# Altium schematic sheet 28Pins_Project_V1_Schematic.SchDoc
size A2
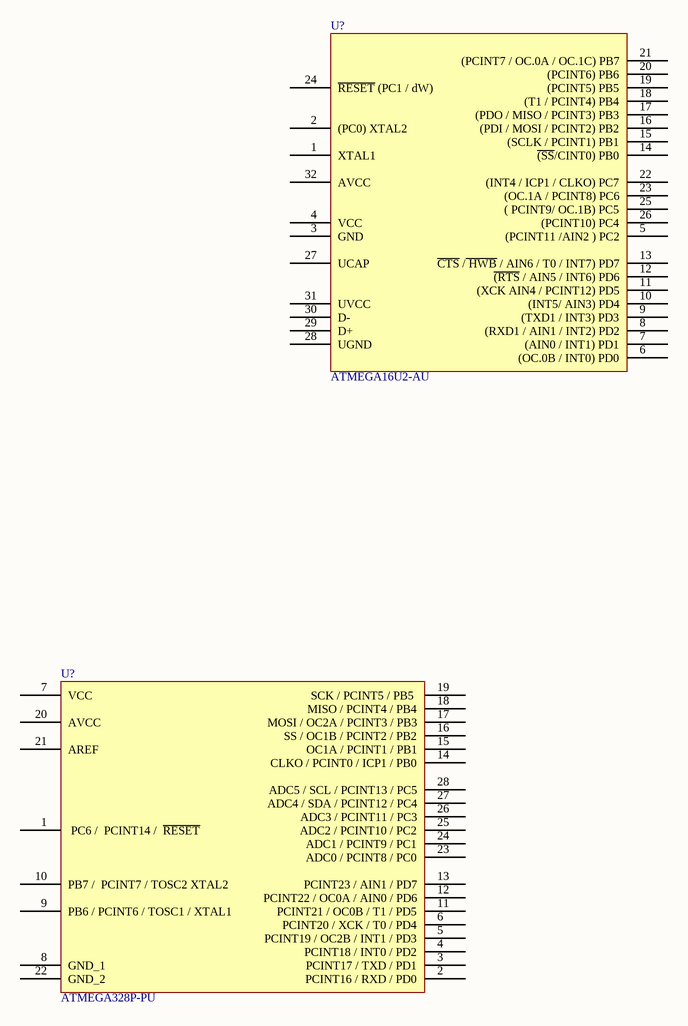
[diagram p0: 28Pins_Project_V1_Schematic.SchDoc]

## Parts
(Parts that share a designator on the sheet are numbered #1, #2 ... from top to bottom, then left to right.)
U?#1  ATMEGA16U2-AU  [TQFP32]
U?#2  ATMEGA328P-PU  [DIP_28_7.62mm]

## Nets

Not connected (* = marked no-connect by the designer): U?#1 1(XTAL1) 2((PC0)_XTAL2) 3(GND) 4(VCC) 5((PCINT11_/AIN2_)_PC2) 6((OC.0B_/_INT0)_PD0) 7((AIN0_/_INT1)_PD1) 8((RXD1_/_AIN1_/_INT2)_PD2) 9((TXD1_/_INT3)_PD3) 10((INT5/_AIN3)_PD4) 11((XCK_AIN4_/_PCINT12)_PD5) 12(~{(RTS}_/_AIN5_/_INT6)_PD6) 13(~{CTS}_/~{_HWB}_/_AIN6_/_T0_/_INT7)_PD7) 14(~{(SS}/CINT0)_PB0) 15((SCLK_/_PCINT1)_PB1) 16((PDI_/_MOSI_/_PCINT2)_PB2) 17((PDO_/_MISO_/_PCINT3)_PB3) 18((T1_/_PCINT4)_PB4) 19((PCINT5)_PB5) 20((PCINT6)_PB6) 21((PCINT7_/_OC.0A_/_OC.1C)_PB7) 22((INT4_/_ICP1_/_CLKO)_PC7) 23((OC.1A_/_PCINT8)_PC6) 24(~{RESET}_(PC1_/_dW)) 25((_PCINT9/_OC.1B)_PC5) 26((PCINT10)_PC4) 27(UCAP) 28(UGND) 29(D+) 30(D-) 31(UVCC) 32(AVCC); U?#2 1(_PC6_/__PCINT14_/__~{RESET}) 2(PCINT16_/_RXD_/_PD0) 3(PCINT17_/_TXD_/_PD1) 4(PCINT18_/_INT0_/_PD2) 5(PCINT19_/_OC2B_/_INT1_/_PD3) 6(PCINT20_/_XCK_/_T0_/_PD4) 7(VCC) 8(GND_1) 9(PB6_/_PCINT6_/_TOSC1_/_XTAL1) 10(PB7_/__PCINT7_/_TOSC2_XTAL2) 11(PCINT21_/_OC0B_/_T1_/_PD5) 12(PCINT22_/_OC0A_/_AIN0_/_PD6) 13(PCINT23_/_AIN1_/_PD7) 14(CLKO_/_PCINT0_/_ICP1_/_PB0) 15(OC1A_/_PCINT1_/_PB1) 16(SS_/_OC1B_/_PCINT2_/_PB2) 17(MOSI_/_OC2A_/_PCINT3_/_PB3) 18(MISO_/_PCINT4_/_PB4) 19(SCK_/_PCINT5_/_PB5_) 20(AVCC) 21(AREF) 22(GND_2) 23(ADC0_/_PCINT8_/_PC0) 24(ADC1_/_PCINT9_/_PC1) 25(ADC2_/_PCINT10_/_PC2) 26(ADC3_/_PCINT11_/_PC3) 27(ADC4_/_SDA_/_PCINT12_/_PC4) 28(ADC5_/_SCL_/_PCINT13_/_PC5)

## Library data of the parts
U?#1 = ATMEGA16U2-AU: MICROCHIP - ATMEGA16U2-AU - MCU, 8BIT, MEGAAVR, 16MHZ, TQFP-32; Manufacturer: Microchip / Atmel; Core Architecture: AVR; Interface: SPI,UART,USB,USART,Serial; Data Bus Width: 8b; Memory Type: FLASH; Memory Size: 16KB; RAM Size: 512B; Number of I/Os: 22; Number of Timers/Counters: 2; Max Supply Voltage: 5.5V; Min Supply Voltage: 2.7V; Oscillator Type: Internal; Watchdog Timer: Yes; Peripherals: Brown-out Detect/Reset,POR,PWM,WDT; Number of PWM Channels: 5; Number of SPI Channels: 1; Supplier 1: Digi-Key; Manufacturer Part Number: ATMEGA16U2-AU; RoHS: Yes; Category: Microcontrollers; Stock 1: 3618; Pricing 1: 1=2.45000, 25=2.25000, 100=2.04000 (USD); Mount: Surface Mount; Case/Package: A; Number of Pins: 32; Contact Plating: Tin,Matte; Min Operating Temperature: -40°C; Max Operating Temperature: 85°C; Package Quantity: 1250; Frequency: 16MHz; Packaging: Tray; Number of Programmable I/O: 22; Max Frequency: 16MHz; Length: 7mm; Width: 7mm; Height: 1.05mm; REACH SVHC: No SVHC; Lead Free: Lead Free; ComponentLink1URL: https://datasheet.ciiva.com/13036/doc7799-28769-13036800.pdf?src-supplier=Mouser; ComponentLink1Description: https://datasheet.ciiva.com/13036/doc7799-28769-13036800.pdf?src-supplier=Mouser; ComponentLink2URL: https://datasheet.ciiva.com/22651/doc7799-22651110.pdf?src-supplier=Farnell; ComponentLink2Description: https://datasheet.ciiva.com/22651/doc7799-22651110.pdf?src-supplier=Farnell; Supplier Part Number 1: ATMEGA16U2-AU-ND
U?#2 = ATMEGA328P-PU: ATMEGA328P-PU; 8 bit Microcontroller AVR 20MHz 1; 32kb Flash; 2kb RAM; I2C SPI 2; Manufacturer: Microchip / Atmel; Number of PWM Channels: 6; Number of Timers/Counters: 3; Min Supply Voltage: 1.8V; Max Supply Voltage: 5.5V; Interface: I2C,SPI,UART,USART,2-Wire; Number of I/Os: 23; Oscillator Type: Internal; Data Bus Width: 8b; Number of SPI Channels: 1; Watchdog Timer: Yes; Peripherals: Brown-out Detect/Reset,POR,PWM,WDT; Supplier 1: Digi-Key; Manufacturer Part Number: ATMEGA328P-PU; RoHS: Yes; Category: Microcontrollers; Stock 1: 7101; Pricing 1: 1=2.08000, 25=1.91000, 100=1.73000 (USD); Mount: Through Hole; Case/Package: PDIP; Number of Pins: 28; Contact Plating: Tin,Matte; Min Operating Temperature: -40°C; Max Operating Temperature: 85°C; Package Quantity: 14; Core Architecture: AVR; RAM Size: 2KB; Number of ADC Channels: 6; Packaging: Rail/Tube; Frequency: 20MHz; Number of Programmable I/O: 23; Max Frequency: 20MHz; Number of I2C Channels: 1; Memory Type: FLASH; Memory Size: 32KB; Length: 37.4mm; Height: 3.28mm; Width: 6.76mm; Radiation Hardening: No; REACH SVHC: No SVHC; Lead Free: Lead Free; ComponentLink1URL: https://datasheet.ciiva.com/1157/1684409-1157696.pdf?src-supplier=Element14; ComponentLink1Description: https://datasheet.ciiva.com/1157/1684409-1157696.pdf?src-supplier=Element14; ComponentLink2URL: https://datasheet.ciiva.com/20168/73-4283-20168380.pdf?src-supplier=Rapid+Electronics; ComponentLink2Description: https://datasheet.ciiva.com/20168/73-4283-20168380.pdf?src-supplier=Rapid+Electronics; ComponentLink3URL: https://datasheet.ciiva.com/19457/2139111-19457070.pdf?src-supplier=Jameco; ComponentLink3Description: https://datasheet.ciiva.com/19457/2139111-19457070.pdf?src-supplier=Jameco; ComponentLink4URL: https://datasheet.ciiva.com/29119/155197-da-01-en-microcontr-atmega328p-pu-8bit-pdip-28-29119593.pdf?src-supplier=Conrad; ComponentLink4Description: https://datasheet.ciiva.com/29119/155197-da-01-en-microcontr-atmega328p-pu-8bit-pdip-28-29119593.pdf?src-supplier=Conrad; ComponentLink5URL: https://datasheet.ciiva.com/26818/atmega328p-pu-26818578.pdf?src-supplier=IIIC; ComponentLink5Description: https://datasheet.ciiva.com/26818/atmega328p-pu-26818578.pdf?src-supplier=IIIC; ComponentLink6URL: https://datasheet.ciiva.com/15213/getdatasheetpartid-318533-15213133.pdf?src-supplier=Verical; ComponentLink6Description: https://datasheet.ciiva.com/15213/getdatasheetpartid-318533-15213133.pdf?src-supplier=Verical; Supplier Part Number 1: ATMEGA328P-PU-ND